# EAGLE design numpad_v1a (EAGLE 9.2.1)

## Sheet 1 of 2: Key Matrix
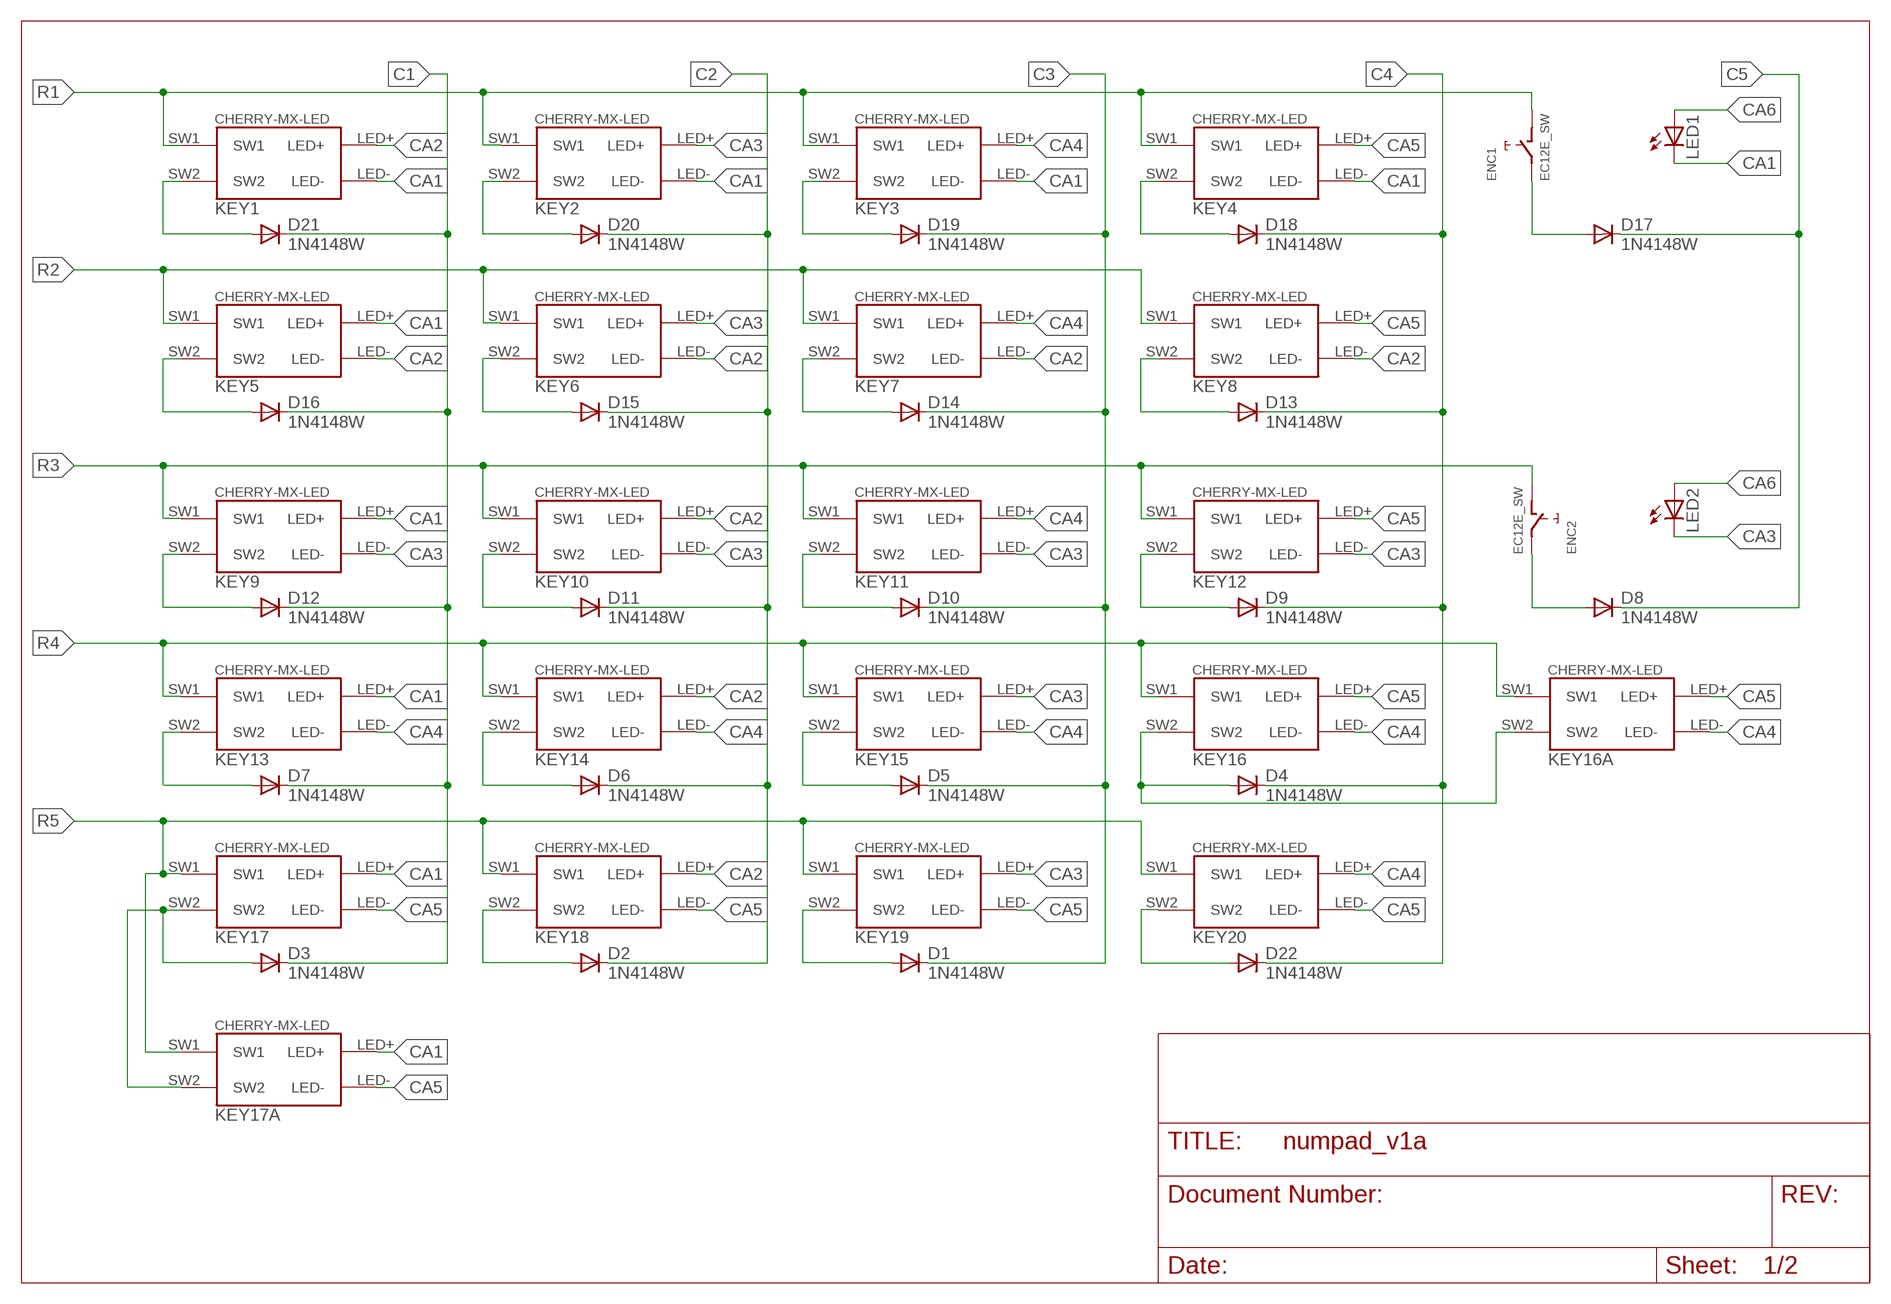
[diagram p0: schematic, sheet 1]

### Parts
D1  1N4148W  DIODE-SOD123  [SOD123]
D2  1N4148W  DIODE-SOD123  [SOD123]
D3  1N4148W  DIODE-SOD123  [SOD123]
D4  1N4148W  DIODE-SOD123  [SOD123]
D5  1N4148W  DIODE-SOD123  [SOD123]
D6  1N4148W  DIODE-SOD123  [SOD123]
D7  1N4148W  DIODE-SOD123  [SOD123]
D8  1N4148W  DIODE-SOD123  [SOD123]
D9  1N4148W  DIODE-SOD123  [SOD123]
D10  1N4148W  DIODE-SOD123  [SOD123]
D11  1N4148W  DIODE-SOD123  [SOD123]
D12  1N4148W  DIODE-SOD123  [SOD123]
D13  1N4148W  DIODE-SOD123  [SOD123]
D14  1N4148W  DIODE-SOD123  [SOD123]
D15  1N4148W  DIODE-SOD123  [SOD123]
D16  1N4148W  DIODE-SOD123  [SOD123]
D17  1N4148W  DIODE-SOD123  [SOD123]
D18  1N4148W  DIODE-SOD123  [SOD123]
D19  1N4148W  DIODE-SOD123  [SOD123]
D20  1N4148W  DIODE-SOD123  [SOD123]
D21  1N4148W  DIODE-SOD123  [SOD123]
D22  1N4148W  DIODE-SOD123  [SOD123]
ENC1  EC12E_SW  [ALPS_EC12E_SW]
ENC2  EC12E_SW  [ALPS_EC12E_SW]
KEY1  CHERRY-MX-LED  [CHERRY-MX-LED]
KEY2  CHERRY-MX-LED  [CHERRY-MX-LED]
KEY3  CHERRY-MX-LED  [CHERRY-MX-LED]
KEY4  CHERRY-MX-LED  [CHERRY-MX-LED]
KEY5  CHERRY-MX-LED  [CHERRY-MX-LED]
KEY6  CHERRY-MX-LED  [CHERRY-MX-LED]
KEY7  CHERRY-MX-LED  [CHERRY-MX-LED]
KEY8  CHERRY-MX-LED  [CHERRY-MX-LED]
KEY9  CHERRY-MX-LED  [CHERRY-MX-LED]
KEY10  CHERRY-MX-LED  [CHERRY-MX-LED]
KEY11  CHERRY-MX-LED  [CHERRY-MX-LED]
KEY12  CHERRY-MX-LED  [CHERRY-MX-LED]
KEY13  CHERRY-MX-LED  [CHERRY-MX-LED]
KEY14  CHERRY-MX-LED  [CHERRY-MX-LED]
KEY15  CHERRY-MX-LED  [CHERRY-MX-LED]
KEY16  CHERRY-MX-LED_NOHOLES  [CHERRY-MX-LED_NOHOLES]
KEY16A  CHERRY-MX-LED  [CHERRY-MX-LED]
KEY17  CHERRY-MX-LED  [CHERRY-MX-LED]
KEY17A  CHERRY-MX-LED_NOHOLES  [CHERRY-MX-LED_NOHOLES]
KEY18  CHERRY-MX-LED  [CHERRY-MX-LED]
KEY19  CHERRY-MX-LED  [CHERRY-MX-LED]
KEY20  CHERRY-MX-LED  [CHERRY-MX-LED]
LED1  LED3MM  [LED3MM]
LED2  LED3MM  [LED3MM]

### Nets
C1: D3.C D7.C D12.C D16.C D21.C ; also sheet 2
C2: D2.C D6.C D11.C D15.C D20.C ; also sheet 2
C3: D1.C D5.C D10.C D14.C D19.C ; also sheet 2
C4: D4.C D9.C D13.C D18.C D22.C ; also sheet 2
C5: D8.C D17.C ; also sheet 2
CA1: KEY1.LED- KEY2.LED- KEY3.LED- KEY4.LED- KEY5.LED+ KEY9.LED+ KEY13.LED+ KEY17.LED+ KEY17A.LED+ LED1.K(C) ; also sheet 2
CA2: KEY1.LED+ KEY5.LED- KEY6.LED- KEY7.LED- KEY8.LED- KEY10.LED+ KEY14.LED+ KEY18.LED+ ; also sheet 2
CA3: KEY2.LED+ KEY6.LED+ KEY9.LED- KEY10.LED- KEY11.LED- KEY12.LED- KEY15.LED+ KEY19.LED+ LED2.K(C) ; also sheet 2
CA4: KEY3.LED+ KEY7.LED+ KEY11.LED+ KEY13.LED- KEY14.LED- KEY15.LED- KEY16.LED- KEY16A.LED- KEY20.LED+ ; also sheet 2
CA5: KEY4.LED+ KEY8.LED+ KEY12.LED+ KEY16.LED+ KEY16A.LED+ KEY17.LED- KEY17A.LED- KEY18.LED- KEY19.LED- KEY20.LED- ; also sheet 2
CA6: LED1.A LED2.A ; also sheet 2
N$1: D21.A KEY1.SW2
N$2: D16.A KEY5.SW2
N$3: D12.A KEY9.SW2
N$4: D7.A KEY13.SW2
N$5: D15.A KEY6.SW2
N$6: D20.A KEY2.SW2
N$7: D11.A KEY10.SW2
N$8: D6.A KEY14.SW2
N$9: D5.A KEY15.SW2
N$10: D10.A KEY11.SW2
N$11: D14.A KEY7.SW2
N$12: D19.A KEY3.SW2
N$22: D8.A ENC2.E
N$23: D17.A ENC1.E
N$34: D3.A KEY17.SW2 KEY17A.SW2
N$35: D2.A KEY18.SW2
N$36: D1.A KEY19.SW2
N$39: D4.A KEY16.SW2 KEY16A.SW2
N$40: D9.A KEY12.SW2
N$41: D13.A KEY8.SW2
N$42: D18.A KEY4.SW2
N$43: D22.A KEY20.SW2
R1: ENC1.D KEY1.SW1 KEY2.SW1 KEY3.SW1 KEY4.SW1 ; also sheet 2
R2: KEY5.SW1 KEY6.SW1 KEY7.SW1 KEY8.SW1 ; also sheet 2
R3: ENC2.D KEY9.SW1 KEY10.SW1 KEY11.SW1 KEY12.SW1 ; also sheet 2
R4: KEY13.SW1 KEY14.SW1 KEY15.SW1 KEY16.SW1 KEY16A.SW1 ; also sheet 2
R5: KEY17.SW1 KEY17A.SW1 KEY18.SW1 KEY19.SW1 KEY20.SW1 ; also sheet 2

## Sheet 2 of 2: µC, LEDs, Display, Encoders
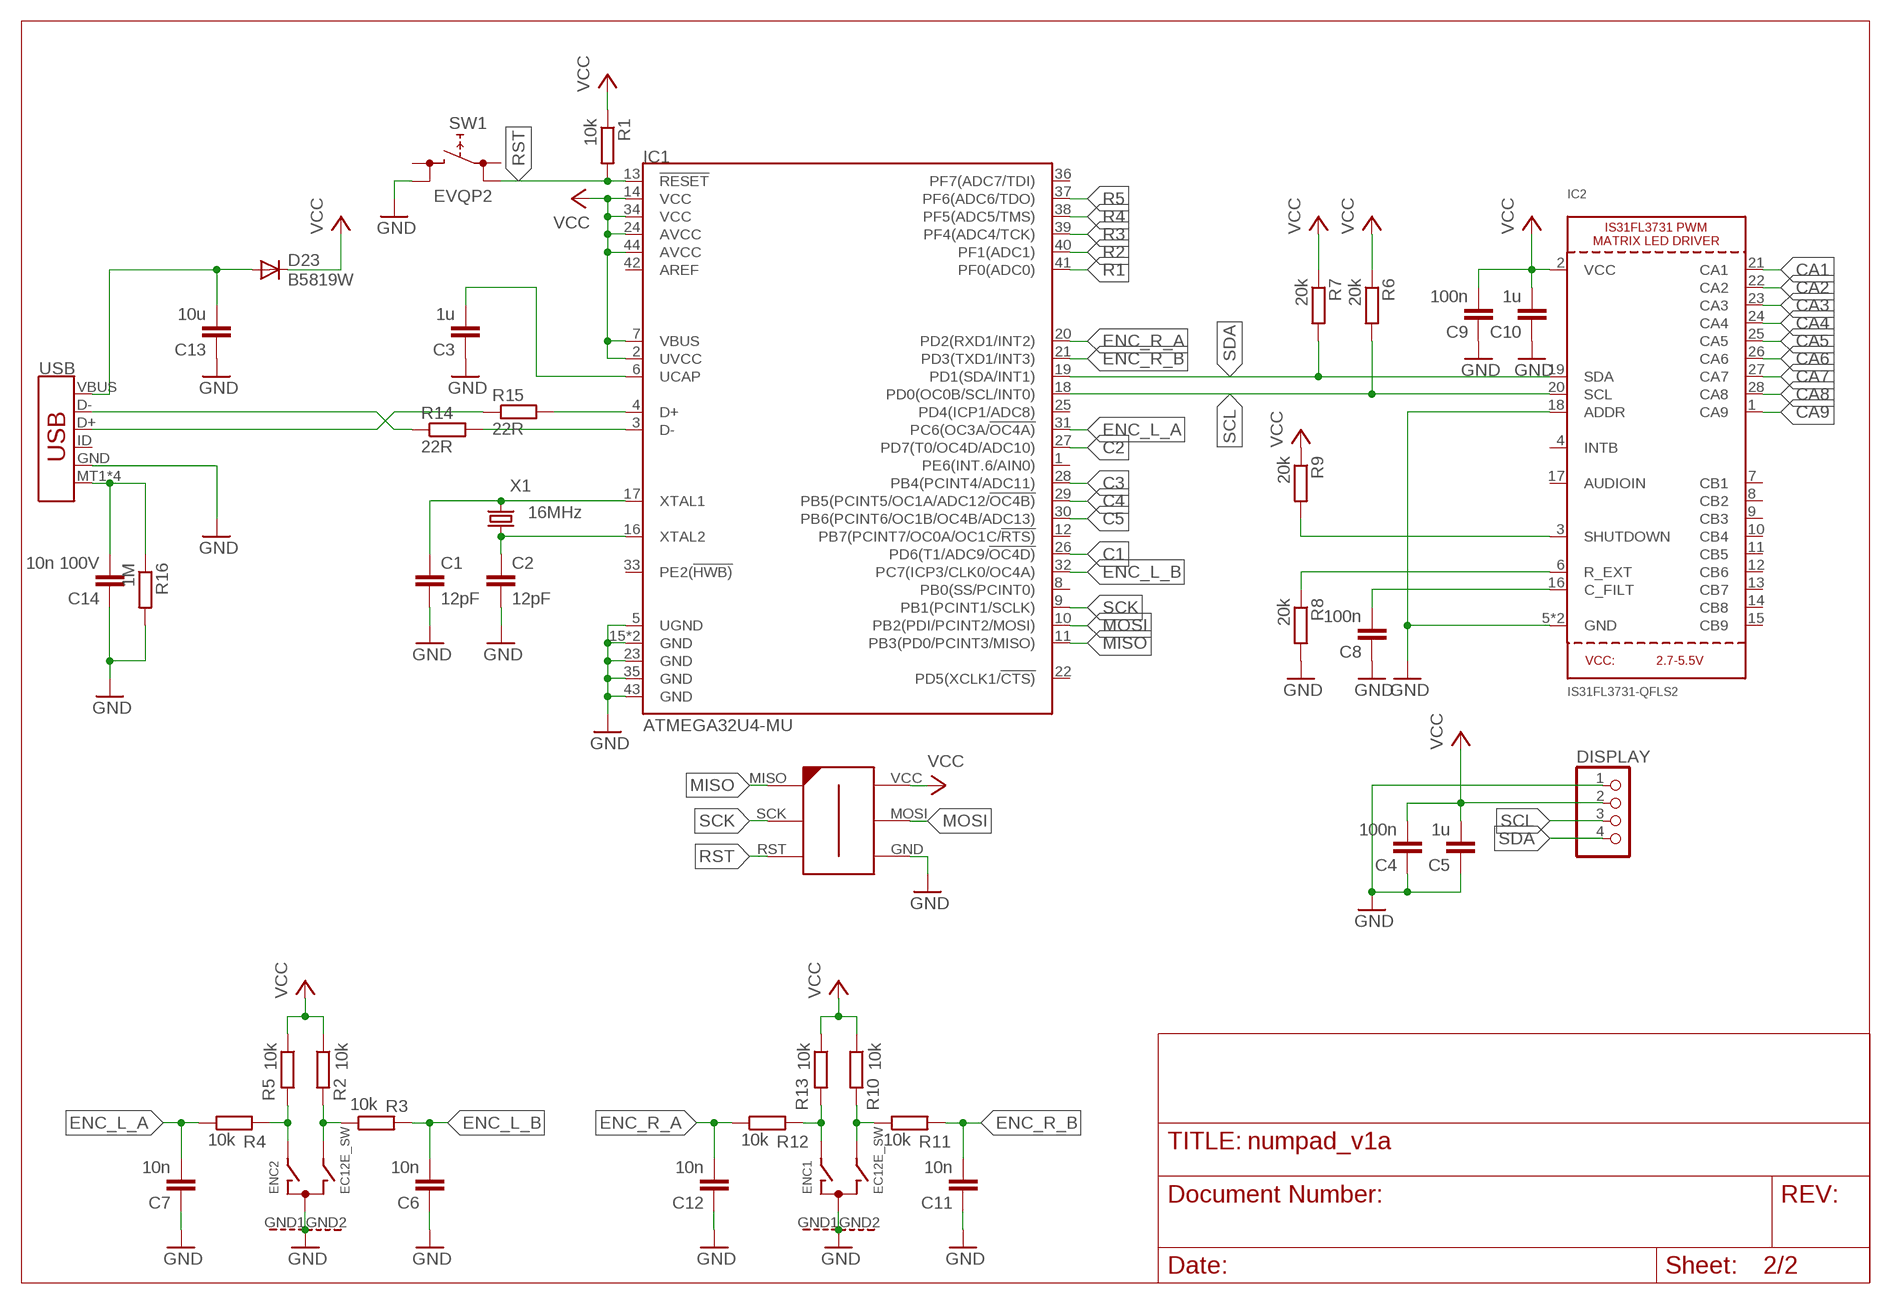
[diagram p1: schematic, sheet 2]

### Parts
C1  12pF  C-EUC0603  [C0603]
C2  12pF  C-EUC0603  [C0603]
C3  1u  C-EUC0603  [C0603]
C4  100n  C-EUC0603  [C0603]
C5  1u  C-EUC0603  [C0603]
C6  10n  C-EUC0603  [C0603]
C7  10n  C-EUC0603  [C0603]
C8  100n  C-EUC0603  [C0603]
C9  100n  C-EUC0603  [C0603]
C10  1u  C-EUC0603  [C0603]
C11  10n  C-EUC0603  [C0603]
C12  10n  C-EUC0603  [C0603]
C13  10u  C-EUC0603  [C0603]
C14  10n 100V  C-EUC0603  [C0603]
D23  B5819W  DIODE-SOD123  [SOD123]
DISPLAY  PINHD-1X4  [1X04]
IC1  ATMEGA32U4-MU  MCU-ATMEGA32U4-MUR(VQFN44)  [QFN44G-0.5-7X7MM]
IC2  IS31FL3731-QFLS2  IS31FL3731QFN  [QFN28_4MM_0.4MM]
ISP  AVR-ISP-6-EDGE  [6PAD_ISP]
R1  10k  R-EU_R0603  [R0603]
R2  10k  R-EU_R0603  [R0603]
R3  10k  R-EU_R0603  [R0603]
R4  10k  R-EU_R0603  [R0603]
R5  10k  R-EU_R0603  [R0603]
R6  20k  R-EU_R0603  [R0603]
R7  20k  R-EU_R0603  [R0603]
R8  20k  R-EU_R0603  [R0603]
R9  20k  R-EU_R0603  [R0603]
R10  10k  R-EU_R0603  [R0603]
R11  10k  R-EU_R0603  [R0603]
R12  10k  R-EU_R0603  [R0603]
R13  10k  R-EU_R0603  [R0603]
R14  22R  R-EU_R0603  [R0603]
R15  22R  R-EU_R0603  [R0603]
R16  1M  R-EU_R0603  [R0603]
SW1  EVQP2  [EVQP2]
USB  USB_MICRO-B_SMT  [USB-MICROB]
X1  16MHz  KX-7  [3.2X2.5_KX-7]

### Nets
C1: IC1.26(PD6(T1/ADC9/!OC4D)) ; also sheet 1
C2: IC1.27(PD7(T0/OC4D/ADC10)) ; also sheet 1
C3: IC1.28(PB4(PCINT4/ADC11)) ; also sheet 1
C4: IC1.29(PB5(PCINT5/OC1A/ADC12/!OC4B)) ; also sheet 1
C5: IC1.30(PB6(PCINT6/OC1B/OC4B/ADC13)) ; also sheet 1
CA1: IC2.21(CA1) ; also sheet 1
CA2: IC2.22(CA2) ; also sheet 1
CA3: IC2.23(CA3) ; also sheet 1
CA4: IC2.24(CA4) ; also sheet 1
CA5: IC2.25(CA5) ; also sheet 1
CA6: IC2.26(CA6) ; also sheet 1
CA7: IC2.27(CA7)
CA8: IC2.28(CA8)
CA9: IC2.1(CA9)
ENC_L_A: C7.2 IC1.31(PC6(OC3A/!OC4A)) R4.1
ENC_L_B: C6.2 IC1.32(PC7(ICP3/CLK0/OC4A)) R3.2
ENC_R_A: C12.2 IC1.20(PD2(RXD1/INT2)) R12.1
ENC_R_B: C11.2 IC1.21(PD3(TXD1/INT3)) R11.2
GND: C1.2 C2.2 C3.1 C4.1 C5.1 C6.1 C7.1 C8.1 C9.1 C10.1 C11.1 C12.1 C13.1 C14.1 DISPLAY.1 ENC1.C ENC1.GND1(G) ENC1.GND2(G) ENC2.C ENC2.GND1(G) ENC2.GND2(G) IC1.5(UGND) IC1.15(GND) IC1.23(GND) IC1.35(GND) IC1.43(GND) IC1.TAB(GND) IC2.5(GND) IC2.18(ADDR) IC2.THERMAL(GND) ISP.GND R8.2 R16.2 SW1.2 USB.GND
MISO: IC1.11(PB3(PD0/PCINT3/MISO)) ISP.MISO
MOSI: IC1.10(PB2(PDI/PCINT2/MOSI)) ISP.MOSI
N$13: IC1.4(D+) R15.2
N$14: IC1.3(D-) R14.2
N$15: R14.1 USB.D-
N$16: R15.1 USB.D+
N$17: C1.1 IC1.17(XTAL1) X1.3
N$18: C13.2 D23.A USB.VBUS
N$19: C2.1 IC1.16(XTAL2) X1.1
N$20: C3.2 IC1.6(UCAP)
N$21: IC2.6(R_EXT) R8.1
N$24: C8.2 IC2.16(C_FILT)
N$25: IC2.3(SHUTDOWN) R9.2
N$26: ENC2.A R4.2 R5.2
N$28: ENC1.A R12.2 R13.2
N$31: ENC2.B R2.2 R3.1
N$33: ENC1.B R10.2 R11.1
N$37: C14.2 R16.1 USB.MT1(SHIELD) USB.MT2(SHIELD) USB.P$1(SHIELD) USB.P$2(SHIELD)
R1: IC1.41(PF0(ADC0)) ; also sheet 1
R2: IC1.40(PF1(ADC1)) ; also sheet 1
R3: IC1.39(PF4(ADC4/TCK)) ; also sheet 1
R4: IC1.38(PF5(ADC5/TMS)) ; also sheet 1
R5: IC1.37(PF6(ADC6/TDO)) ; also sheet 1
RST: IC1.13(!RESET) ISP.RST R1.2 SW1.3
SCK: IC1.9(PB1(PCINT1/SCLK)) ISP.SCK
SCL: DISPLAY.3 IC1.18(PD0(OC0B/SCL/INT0)) IC2.20(SCL) R6.2
SDA: DISPLAY.4 IC1.19(PD1(SDA/INT1)) IC2.19(SDA) R7.2
VCC: C4.2 C5.2 C9.2 C10.2 D23.C DISPLAY.2 IC1.2(UVCC) IC1.7(VBUS) IC1.14(VCC) IC1.24(AVCC) IC1.34(VCC) IC1.44(AVCC) IC2.2(VCC) ISP.VCC R1.1 R2.1 R5.1 R6.1 R7.1 R9.1 R10.1 R13.1
Unconnected: IC1.1(PE6(INT.6/AIN0)) IC1.8(PB0(SS/PCINT0)) IC1.12(PB7(PCINT7/OC0A/OC1C/!RTS)) IC1.22(PD5(XCLK1/!CTS)) IC1.25(PD4(ICP1/ADC8)) IC1.33(PE2(!HWB)) IC1.36(PF7(ADC7/TDI)) IC1.42(AREF) IC2.4(INTB) IC2.7(CB1) IC2.8(CB2) IC2.9(CB3) IC2.10(CB4) IC2.11(CB5) IC2.12(CB6) IC2.13(CB7) IC2.14(CB8) IC2.15(CB9) IC2.17(AUDIOIN) SW1.1 SW1.4 USB.ID

## Library data of the parts
C1 C2 = rcl:C-EU: CAPACITOR, European symbol; LCSC: C38523; SPICEPREFIX: C
C3 C5 C10 = rcl:C-EU: CAPACITOR, European symbol; LCSC: C15849; SPICEPREFIX: C
C4 C8 C9 = rcl:C-EU: CAPACITOR, European symbol; LCSC: C14663; SPICEPREFIX: C
C6 C7 C11 C12 = rcl:C-EU: CAPACITOR, European symbol; LCSC: C57112; SPICEPREFIX: C
C13 = rcl:C-EU: CAPACITOR, European symbol; LCSC: C19702; SPICEPREFIX: C
C14 = rcl:C-EU: CAPACITOR, European symbol; LCSC: C84709; SPICEPREFIX: C
D1-D22 = diode:DIODE-: DIODE; LCSC: C81598
D23 = diode:DIODE-: DIODE; LCSC: C8598
DISPLAY = pinhead:PINHD-1X4: PIN HEADER
ENC1 ENC2 = switch-alps:EC12E_SW: ALPS rotary Encoder EC12E series with switch; MPN: EC12E2424407; OC_FARNELL: 1520813; OC_NEWARK: 74M1068
IC1 = MCU-ATMEGA32U4-MUR_VQFN44_:MCU-ATMEGA32U4-MUR(VQFN44): 310010016; AVAILABILITY: Unavailable; DESCRIPTION: ATmega Series 32 KB Flash 2.5 KB SRAM 16 MHz 8-Bit Microcontroller - MLF/QFN-44; LCSC: C112161; MF: Microchip; MP: ATMEGA32U4-MUR; PACKAGE: VQFN-44 Microchip; PRICE: None
IC2 = microbuilder:IS31FL3731: IS31FL3731 PWM LED Matrix Driver
ISP = avr-7:AVR-ISP-6-EDGE: 6 pin edge connector for ISP with ATMEL MCUs. Developed by Craig Moates (craig at moates dot net). Library by David Blundell (blundar at gmail dot com). Often, even a 6 pin header is really inconvenient for board layout and/or production. This SMD-only header is our de-facto standard for using an edge connector for programming with the help of a 6pin/10pin to edge card adapter.
KEY1-KEY16 KEY16A KEY17 KEY17A KEY18-KEY20 = cherrymx:CHERRY-MX-LED: Cherry MX series keyswitch with LED
LED1 LED2 = led:LED: LED OSRAM: - CHIPLED LG R971, LG N971, LY N971, LG Q971, LY Q971, LO R971, LY R971 LH N974, LH R974 LS Q976, LO Q976, LY Q976 LO Q996 - Hyper CHIPLED LW Q18S LB Q993, LB Q99A, LB R99A - SideLED LS A670, LO A670, LY A670, LG A670, LP A670 LB A673, LV A673, LT A673, LW A673 LH A674 LY A675 LS A676, LA A676, LO A676, LY A676, LW A676 LS A679, LY A679, LG A679 - Hyper Micro SIDELED® LS Y876, LA Y876, LO Y876, LY Y876 LT Y87S - SmartLED LW L88C, LW L88S LB L89C, LB L89S, LG L890 LS L89K, LO L89K, LY L89K LS L896, LA L896, LO L896, LY L896 - TOPLED LS T670, LO T670, LY T670, LG T670, LP T670 LSG T670, LSP T670, LSY T670, LOP T670, LYG T670 LG T671, LOG T671, LSG T671 LB T673, LV T673, LT T673, LW T673 LH T674 LS T676, LA T676, LO T676, LY T676, LB T676, LH T676, LSB T676, LW T676 LB T67C, LV T67C, LT T67C, LS T67K, LO T67K, LY T67K, LW E67C LS E67B, LA E67B, LO E67B, LY E67B, LB E67C, LV E67C, LT E67C LW T67C LS T679, LY T679, LG T679 LS T770, LO T770, LY T770, LG T770, LP T770 LB T773, LV T773, LT T773, LW T773 LH T774 LS E675, LA E675, LY E675, LS T675 LS T776, LA T776, LO T776, LY T776, LB T776 LHGB T686 LT T68C, LB T68C - Hyper Mini TOPLED® LB M676 - Mini TOPLED Santana® LG M470 LS M47K, LO M47K, LY M47K Source: http://www.osram.convergy.de LUXEON: - LUMILED® LXK2-PW12-R00, LXK2-PW12-S00, LXK2-PW14-U00, LXK2-PW14-V00 LXK2-PM12-R00, LXK2-PM12-S00, LXK2-PM14-U00 LXK2-PE12-Q00, LXK2-PE12-R00, LXK2-PE12-S00, LXK2-PE14-T00, LXK2-PE14-U00 LXK2-PB12-K00, LXK2-PB12-L00, LXK2-PB12-M00, LXK2-PB14-N00, LXK2-PB14-P00, LXK2-PB14-Q00 LXK2-PR12-L00, LXK2-PR12-M00, LXK2-PR14-Q00, LXK2-PR14-R00 LXK2-PD12-Q00, LXK2-PD12-R00, LXK2-PD12-S00 LXK2-PH12-R00, LXK2-PH12-S00 LXK2-PL12-P00, LXK2-PL12-Q00, LXK2-PL12-R00 Source: www.luxeon.com KINGBRIGHT: KA-3528ASYC Source: www.kingbright.com
R1-R5 R10-R13 = rcl:R-EU_: RESISTOR, European symbol; LCSC: C25804; SPICEPREFIX: R
R6-R9 = rcl:R-EU_: RESISTOR, European symbol; LCSC: C4184; SPICEPREFIX: R
R14 R15 = rcl:R-EU_: RESISTOR, European symbol; LCSC: C23345; SPICEPREFIX: R
R16 = rcl:R-EU_: RESISTOR, European symbol; LCSC: C22935; SPICEPREFIX: R
SW1 = switch:EVQP2; FARNELL: 2079559; MBM: 1; PREIS: 0,738
USB = SparkFun-Connectors:USB_MICRO-B: USB Type Micro-B Connector Male/female and PTH/SMT variants SparkFun Products: SparkFun microB USB Breakout <https://www.sparkfun.com/products/12035> SparkFun USB microB Plug Breakout <https://www.sparkfun.com/products/10031> SparkFun ESP8266 Thing <https://www.sparkfun.com/products/13231>; DIGIKEY: 609-4052-1-ND; MBM: 1; PREIS: 0.7; PROD_ID: CONN-09505; SF_ID: PRT-08533
X1 = crystal-geyer_V1_0:KX: Quartz Crystals (MHz) SMD: KX - Serie Model Size l/w/h [mm] Frequency Range Frequency Stability Temp. Range [°C] Load Capacitance AECQ 200 availabel Datasheet KX-4 KX-5 KX-6 KX-7 KX-9A KX-9B KX-12A KX-12B KX-13 KX-20 KX-K KX-KS 1.6/1.2/0.3 2.0/1.6/0.45 2.5/2.0/0.55 3.2/2.5/0.8 5.0/3.2/1.0 5.0/3.2/1.1 6.0/3.5/1.1 6.0/3.5/1.0 7.0/5.0 /1.3 11.6/5.5/1.6 12.3/4.5/4.2 12.3/4.5/3.2 24.0 ~ 80.0 MHz 16.0 ~ 80.0 MHz 12.0 ~ 80.0 MHz 8.0 ~ 60.0 MHz 7,68 ~ 300,0 MHz 8,0 ~ 50,0 MHz 8,0 ~ 150,0 MHz 8,0 ~ 50,0 MHz 6,0 ~ 160,0 MHz 3,579 ~ 25,0 MHz 3,579 ~ 70,0 MHz 3,579 ~ 70,0 MHz ±10 … ±50ppm ±10 … ±50ppm ±10 … ±50ppm ±10 … ±50ppm ±10 … ±50ppm ±10 … ±50ppm ±10 … ±50ppm ±10 … ±50ppm ±10 … ±50ppm ±50ppm ±10 … ±50ppm ±10 … ±50ppm (*) -40°C …+85°C (*) -40°C …+125°C (*) -40°C …+125°C (*) -40°C …+125°C (*) -40°C …+105°C (*) -40°C …+105°C (*) -40°C …+125°C (*) -40°C …+105°C (*) -40°C …+105°C (*) -40°C …+105°C (*) -40°C …+85°C (*) -40°C …+85°C 8, 8…16 8, 8…16 10, 8…16 12, 7…20 16, 10…20 16, 10…20 16, 10…20 16, 12…20 16, 12…20 16, 12…20 16, 12…30 16, 12…30 - yes yes yes - - - - - - - - KX-4.pdf <http://www.geyer-electronic.de/uploads/tx_userartikelfrequenz/GEYER-KX-4.pdf> KX-5.pdf <http://www.geyer-electronic.de/uploads/tx_userartikelfrequenz/GEYER-KX-5.pdf> KX-6.pdf <http://www.geyer-electronic.de/uploads/tx_userartikelfrequenz/GEYER-KX-6.pdf> KX-7.pdf <http://www.geyer-electronic.de/uploads/tx_userartikelfrequenz/GEYER-KX-7.pdf> KX-9A.pdf <http://www.geyer-electronic.de/uploads/tx_userartikelfrequenz/GEYER-KX-9A.pdf> KX-9B.pdf <http://www.geyer-electronic.de/uploads/tx_userartikelfrequenz/GEYER-KX-9B.pdf> KX-12A.pdf <http://www.geyer-electronic.de/uploads/tx_userartikelfrequenz/GEYER-KX-12A.pdf> KX-12B.pdf <http://www.geyer-electronic.de/uploads/tx_userartikelfrequenz/GEYER-KX-12B.pdf> KX-13.pdf <http://www.geyer-electronic.de/uploads/tx_userartikelfrequenz/GEYER-KX-13.pdf> KX-20.pdf <http://www.geyer-electronic.de/uploads/tx_userartikelfrequenz/GEYER-KX-20.pdf> KX-K.pdf <http://www.geyer-electronic.de/uploads/tx_userartikelfrequenz/GEYER-KX-K.pdf> KX-KS.pdf <http://www.geyer-electronic.de/uploads/tx_userartikelfrequenz/GEYER-KX-KS.pdf> <http://www.geyer-electronic.de/fileadmin/template/img/logo-geyer-electronic.png> Details see: http://www.geyer-electronic.de/Frequenz-Produkte.9.0.html Created 2016-06-07, Hans Locher 2016 (C) Geyer Quartz Technology KX4,KX5,KX6,KX7,KX9A,KX9B,KX12A,KX12B,KX13,KX20,KXK,KXKS;1612;2016;2520;3225;5032;6035;7050;11655;12345;1,6x1,2;2,0x1,6;2,5x2,0;3,2x2,5;5,0x3,2;6,0x3,5;7,0x5,0;11,6x5,5;12,3x4,5;12,3x4,5;1.6x1.2;2.0x1.6;2.5x2.0;3.2x2.5;5.0x3.2;6.0x3.5;7.0x5.0;11.6x5.5;12.3x4.5;12.3x4.5;; LCSC: C13738

## Board
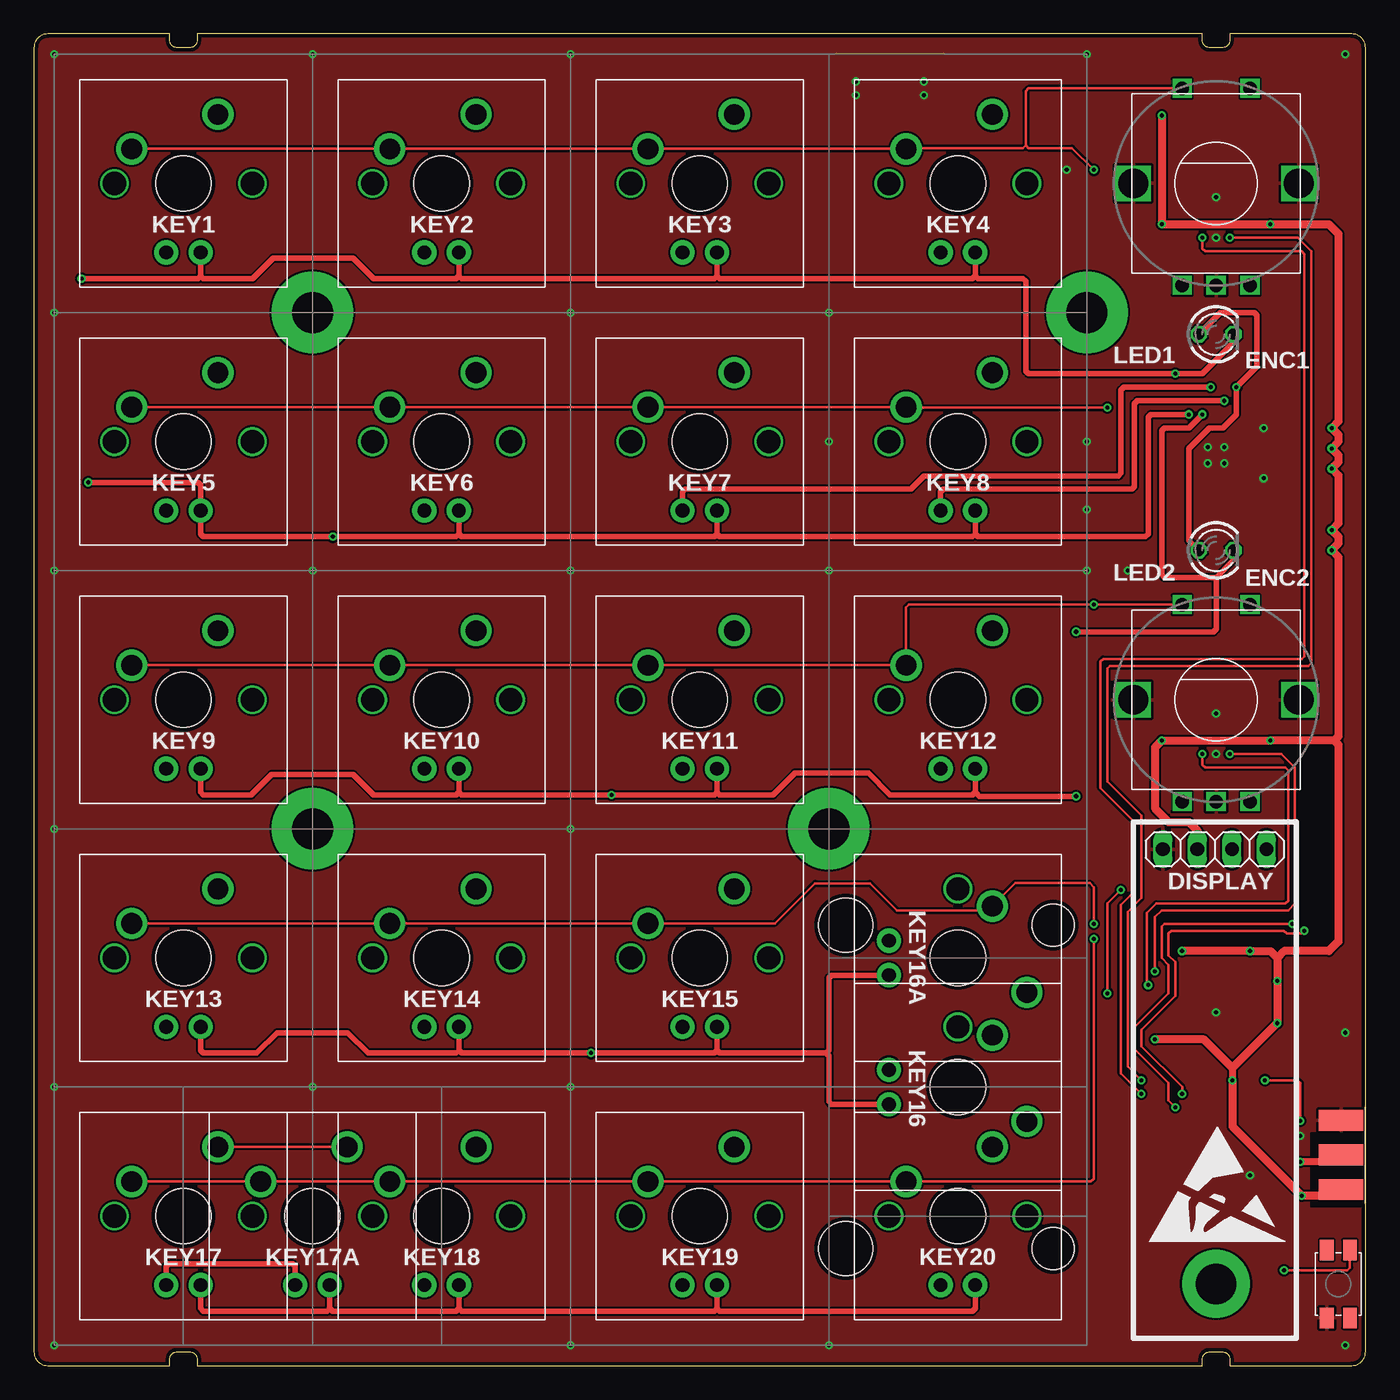
[diagram p2: board, top side]
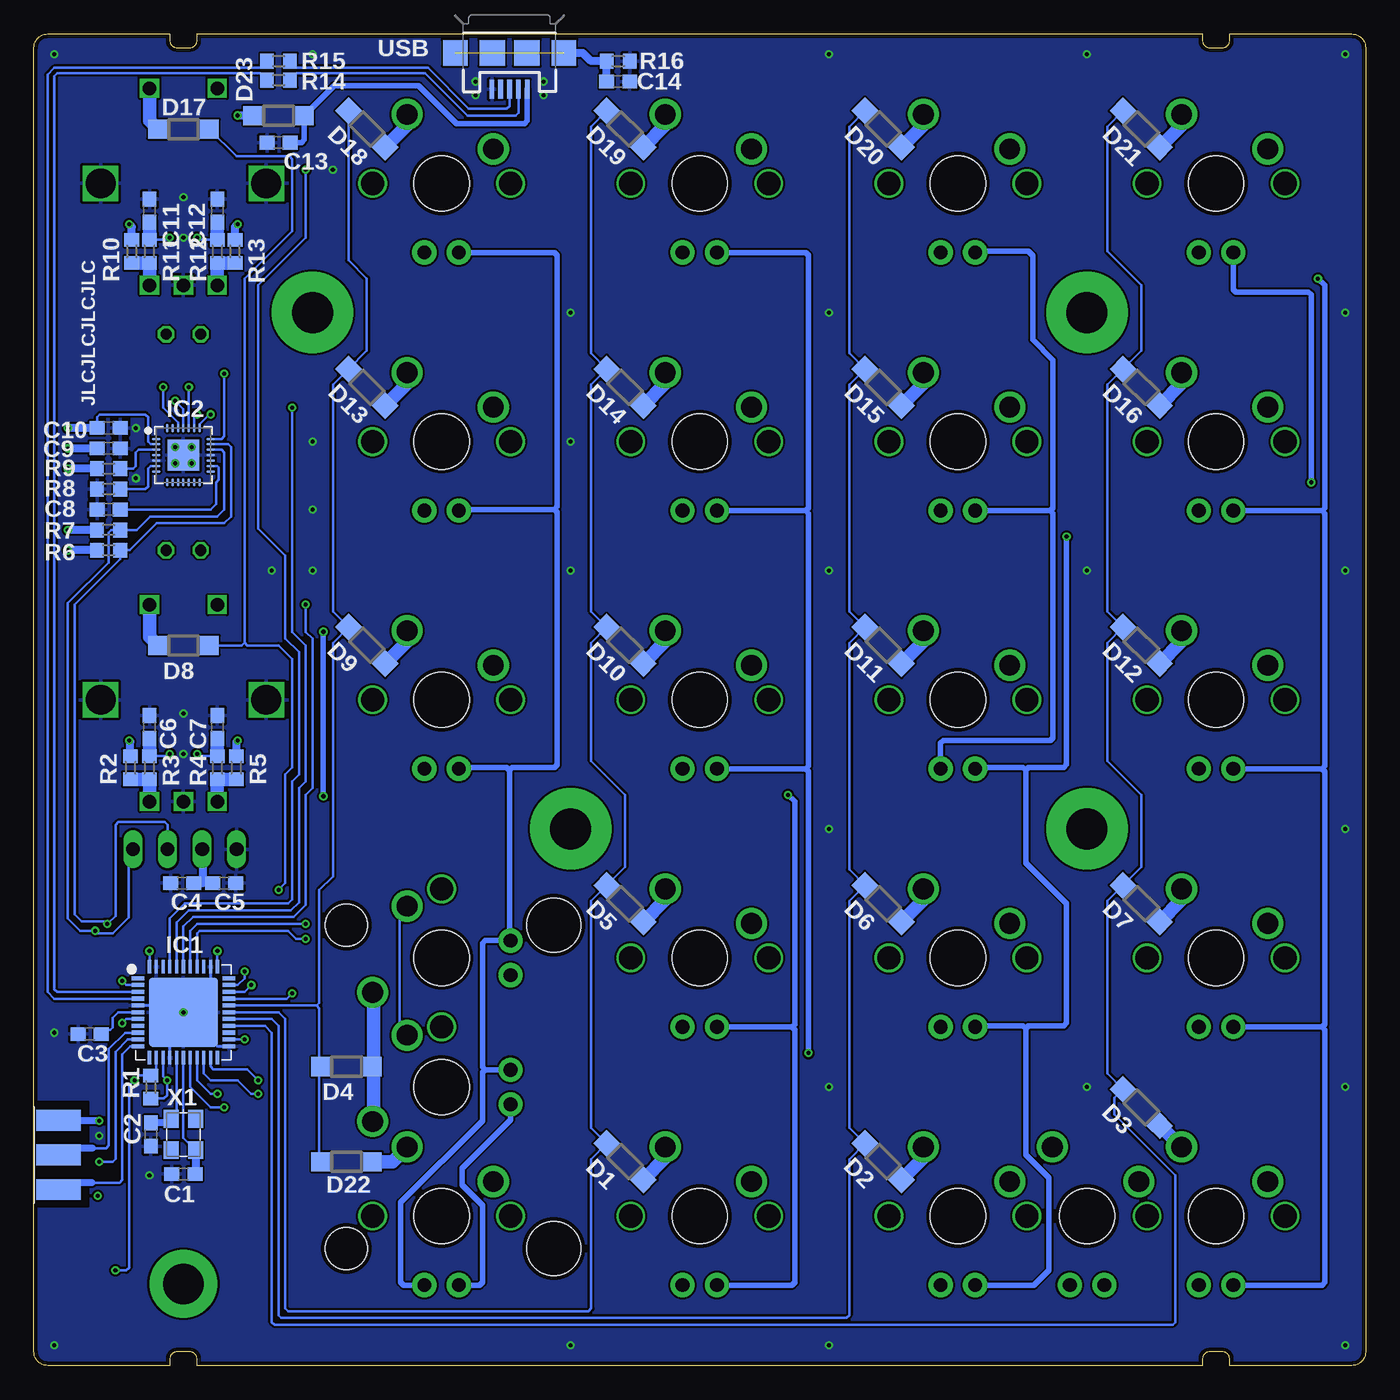
[diagram p3: board, bottom side, seen from below]

Size 98 x 98 mm. Coordinates in mm from the lower left corner, seen from the top.
Outline: 97,98 88,98 88,97.5 arc-90 87.5,97 86.5,97 arc-90 86,97.5 86,98 12,98 12,97.5 arc-90 11.5,97 10.5,97 arc-90 10,97.5 10,98 1,98 arc90 0,97 0,1 arc90 1,0 10,0 10,0.5 arc-90 10.5,1 11.5,1 arc-90 12,0.5 12,0 86,0 86,0.5 arc-90 86.5,1 87.5,1 arc-90 88,0.5 88,0 97,0 arc90 98,1 98,97 arc90 97,98
Copper layers (1*16): Top 0.035mm / dielectric 1.5mm / Bottom 0.035mm
Design rules "PCB-POOL Standard *": minimum track width 0.15mm, minimum drill 0.3mm, track to track 0.15mm, track to pad 0.15mm, pad to pad 0.15mm, via to via 0.15mm, smd to smd 0.15mm, copper to edge 0.3mm, drill to drill 0.2mm, minimum pad ring 0.2mm, minimum via ring 0.15mm, stop-mask expansion 0.075mm, vias tented up to drill 0.3mm, thermal gap 0.2mm
Holes 3.1 mm at 75,32.4 75,8.6
Holes 4 mm at 59.75,8.6 59.75,32.4
tRestrict: 3 lines
bRestrict: 3 lines

### Footprints (pad centres in the part's own frame; a part is rotated, then mirrored left to right if it is on the bottom)
C0603 = smd 1.1 x 1: 1 -0.85,0; 2 0.85,0
SOD123 = smd 1.4 x 1.4: A 1.9,0; C -1.9,0
1X04 = drill 1.016 long: 1 -3.81,0; 2 -1.27,0; 3 1.27,0; 4 3.81,0
ALPS_EC12E_SW = drill 1 square: A -2.5,-7.5; B 2.5,-7.5; C 0,-7.5; D -2.5,7; E 2.5,7 | drill 2.2 square: GND1 -6.1,0; GND2 6.1,0
QFN44G-0.5-7X7MM = smd 1 x 0.3: 1 -3.35,2.5; 2 -3.35,2; 3 -3.35,1.5; 4 -3.35,1; 5 -3.35,0.5; 6 -3.35,0; 7 -3.35,-0.5; 8 -3.35,-1; 9 -3.35,-1.5; 10 -3.35,-2; 11 -3.35,-2.5; 23 3.35,-2.5; 24 3.35,-2; 25 3.35,-1.5; 26 3.35,-1; 27 3.35,-0.5; 28 3.35,0; 29 3.35,0.5; 30 3.35,1; 31 3.35,1.5; 32 3.35,2; 33 3.35,2.5 | smd 0.3 x 1: 12 -2.5,-3.35; 13 -2,-3.35; 14 -1.5,-3.35; 15 -1,-3.35; 16 -0.5,-3.35; 17 0,-3.35; 18 0.5,-3.35; 19 1,-3.35; 20 1.5,-3.35; 21 2,-3.35; 22 2.5,-3.35; 34 2.5,3.35; 35 2,3.35; 36 1.5,3.35; 37 1,3.35; 38 0.5,3.35; 39 0,3.35; 40 -0.5,3.35; 41 -1,3.35; 42 -1.5,3.35; 43 -2,3.35; 44 -2.5,3.35 | smd 5.08 x 5.08: TAB 0,0
QFN28_4MM_0.4MM = smd 0.6 x 0.18: 1 -2,1.2; 2 -2,0.8; 3 -2,0.4; 4 -2,0; 5 -2,-0.4; 6 -2,-0.8; 7 -2,-1.2; 15 2,-1.2; 16 2,-0.8; 17 2,-0.4; 18 2,0; 19 2,0.4; 20 2,0.8; 21 2,1.2 | smd 0.18 x 0.6: 8 -1.2,-2; 9 -0.8,-2; 10 -0.4,-2; 11 0,-2; 12 0.4,-2; 13 0.8,-2; 14 1.2,-2; 22 1.2,2; 23 0.8,2; 24 0.4,2; 25 0,2; 26 -0.4,2; 27 -0.8,2; 28 -1.2,2 | smd 2.3 x 2.3: THERMAL 0,0
6PAD_ISP = smd 1.524 x 3.302 bottom: GND 2.54,0; MOSI 0,0; VCC -2.54,0 | smd 1.524 x 3.302: MISO -2.54,0; RST 2.54,0; SCK 0,0
CHERRY-MX-LED = drill 1.016 pad 1.778: LED+ -1.27,-5.08; LED- 1.27,-5.08 | drill 1.714 pad 1.93: P$3 -5.08,0; P$4 5.08,0 | drill 1.524 pad 2.286: SW1 -3.81,2.54; SW2 2.54,5.08 | hole 4.064: 0,0
CHERRY-MX-LED_NOHOLES = drill 1.016 pad 1.778: LED+ -1.27,-5.08; LED- 1.27,-5.08 | drill 1.524 pad 2.286: SW1 -3.81,2.54; SW2 2.54,5.08 | hole 4.064: 0,0
LED3MM = drill 0.813 octagon: A -1.27,0; K 1.27,0
R0603 = smd 1 x 1.1: 1 -0.85,0; 2 0.85,0
EVQP2 = smd 1.5 x 1: 1 -2.5,-0.85; 2 -2.5,0.85; 3 2.5,-0.85; 4 2.5,0.85
USB-MICROB = smd 1.4 x 0.35: D+ -2.65,0; D- -2.65,-0.65; GND -2.65,1.3; ID -2.65,0.65; VBUS -2.65,-1.3 | smd 1.9 x 1.8: MT1 0,-4; MT2 0,4 | smd 1.9 x 1.9: P$1 0,-1.27; P$2 0,1.27
3.2X2.5_KX-7 = smd 1.3 x 1.1: 1 -1.15,-0.9; 2 1.15,-0.9; 3 1.15,0.9; 4 -1.15,0.9

### Placement (x,y rotation side)
C1  87,14.1 180 bottom
C2  89.4,17 270 bottom
C3  93.9,24.4 0 bottom
C4  87.1,35.5 0 bottom
C5  84,35.5 180 bottom
C6  89.5,47 270 bottom
C7  84.5,47 270 bottom
C8  92.5,63 0 bottom
C9  92.5,67.5 180 bottom
C10  92.5,69 180 bottom
C11  89.5,85 270 bottom
C12  84.5,85 270 bottom
C13  80,90 0 bottom
C14  55,94.5 180 bottom
D1  54.5,15 315 bottom
D2  35.5,15 315 bottom
D3  16.5,19 315 bottom
D4  75,22 0 bottom
D5  54.5,34 315 bottom
D6  35.5,34 315 bottom
D7  16.5,34 315 bottom
D8  87,53 180 bottom
D9  73.5,53 315 bottom
D10  54.5,53 315 bottom
D11  35.5,53 315 bottom
D12  16.5,53 315 bottom
D13  73.5,72 315 bottom
D14  54.5,72 315 bottom
D15  35.5,72 315 bottom
D16  16.5,72 315 bottom
D17  87,91 180 bottom
D18  73.5,91 315 bottom
D19  54.5,91 315 bottom
D20  35.5,91 315 bottom
D21  16.5,91 315 bottom
D22  75,15 0 bottom
D23  80,92 0 bottom
DISPLAY  86.9,38 0 top
ENC1  87,87 0 top
ENC2  87,49 0 top
IC1  87,26 0 bottom
IC2  87,67 0 bottom
ISP  96.2,15.5 90 bottom
KEY1  11,87 0 top
KEY2  30,87 0 top
KEY3  49,87 0 top
KEY4  68,87 0 top
KEY5  11,68 0 top
KEY6  30,68 0 top
KEY7  49,68 0 top
KEY8  68,68 0 top
KEY9  11,49 0 top
KEY10  30,49 0 top
KEY11  49,49 0 top
KEY12  68,49 0 top
KEY13  11,30 0 top
KEY14  30,30 0 top
KEY15  49,30 0 top
KEY16  68,20.5 270 top
KEY16A  68,30 270 top
KEY17  11,11 0 top
KEY17A  20.5,11 0 top
KEY18  30,11 0 top
KEY19  49,11 0 top
KEY20  68,11 0 top
LED1  87,75.9 0 top
LED2  87,60 0 top
R1  89.4,20.5 90 bottom
R2  90.9,44 270 bottom
R3  89.5,44 90 bottom
R4  84.5,44 270 bottom
R5  83.1,44 270 bottom
R6  92.5,60 0 bottom
R7  92.5,61.5 0 bottom
R8  92.5,64.5 180 bottom
R9  92.5,66 0 bottom
R10  90.8,82 270 bottom
R11  89.5,82 90 bottom
R12  84.5,82 270 bottom
R13  83.2,82 270 bottom
R14  80,94.6 180 bottom
R15  80,96 180 bottom
R16  55,96 0 bottom
SW1  96,6 90 top
U$1  [ESD_10.00]  82,9 0 top
USB  63,96.6 90 bottom
X1  87,17 270 bottom

### Tracks (layer width: path | path; a pad name or v marks a point on that pad's centre or on a via)
C1
  Bottom 0.2: D21.C 19,91.19 19,82 16.5,79.5 16.5,74.69 D16.C 19,72.19 19,55.5 D12.C 19,53.19 19,44.5 16.5,42 16.5,36.69 D7.C 19,34.19 19,21.5 D3.C 18.5,19.69 18.5,18.5 14,14 14,3.2 14.2,3 80.3,3 80.5,3.2 80.5,24.5 81,25 IC1.26
C2
  Bottom 0.2: D20.C 38,91.19 38,74.5 D15.C 38,72.19 38,55.5 D11.C 38,53.19 38,36.5 D6.C 38,34.19 38,17.5 D2.C 38,15.19 38,3.7 38.2,3.5 79.8,3.5 80,3.7 80,25 80.5,25.5 IC1.27
C3
  Bottom 0.2: D19.C 57,91.19 57,74.5 D14.C 57,72.19 57,55.5 D10.C 57,53.19 57,44.5 54.5,42 54.5,36.69 D5.C 57,34.19 57,17.5 D1.C 57,15.19 57,4.2 57.2,4 79.3,4 79.5,4.2 79.5,25.5 80,26 IC1.28
C4
  Bottom 0.2: D18.C 74.84,81.34 73.5,80 73.5,74.69 D13.C 76,72.19 76,55.5 D9.C 76,53.19 76,36 77,35 77,26.7 77.2,26.5 | IC1.29 77.2,26.5 | 77.2,26.5 77,26.3 77,22.1 D4.C 77,21.9 77,15.1 D22.C
C5  (via drill 0.3)
  Top 0.2: v80,35 79,34 v79,27.4
  Bottom 0.2: D17.C 83.1,89 79.2,89 79,88.8 79,83.5 82.5,80 82.5,53.2 | 82.5,53.2 82.7,53 D8.C | 82.5,53.2 82.3,53 80,53 79,52 79,44 79.5,43.5 79.5,35.5 v80,35 | v79,27.4 79.4,27 IC1.30
CA1  (via drill 0.3)
  Top 0.2: 31.47,80 31.27,80.2
  Top 0.4: KEY1.LED- 12.27,80.2 | 12.27,80.2 12.47,80 16.1,80 17.6,81.5 23.5,81.5 25,80 31.07,80 31.27,80.2 KEY2.LED- | KEY3.LED- 50.27,80.2 | 50.27,80.2 50.07,80 31.47,80 | v3.5,80 12.07,80 12.27,80.2 | KEY4.LED- 69.27,80.2 | 69.27,80.2 69.07,80 50.47,80 50.27,80.2 | 69.27,80.2 69.47,80 72.8,80 73,79.8 73,73.2 73.2,73 v84,73 86,73 88.27,75.27 LED1.K | KEY17.LED+ 9.73,7.3 9.93,7.5 19.03,7.5 19.23,7.3 KEY17A.LED+
  Bottom 0.2: 3.2,62.92 3,63.12 | IC2.21 84.2,68.2 84,68.4 v84,73
  Bottom 0.4: KEY13.LED+ 3.2,24.92 | 3.2,24.92 3,25.12 3,43.72 3.2,43.92 | 3.2,43.92 KEY9.LED+ | 3.2,43.92 3,44.12 3,62.72 3.2,62.92 KEY5.LED+ | v3.5,80 3,79.5 3,63.12 | KEY17.LED+ 3.2,5.92 3,6.12 3,24.72 3.2,24.92
CA2  (via drill 0.3)
  Top 0.4: 31.27,61.2 31.07,61 v22,61 12.47,61 12.27,61.2 KEY5.LED- 12.27,64.8 12.07,65 v4,65 | 31.27,61.2 KEY6.LED- | KEY7.LED- 50.27,61.2 | 50.27,61.2 50.07,61 31.47,61 31.27,61.2 | KEY8.LED- 69.27,61.2 | 69.27,61.2 69.07,61 50.47,61 50.27,61.2 | 69.27,61.2 69.47,61 81.8,61 82,61.2 82,69.8 82.2,70 v85,70
  Bottom 0.2: IC2.22 85.8,69.3 85.1,70 v85,70
  Bottom 0.4: v22,61 22,44.22 22.2,44.02 24.8,44.02 25,43.82 | KEY1.LED+ 9.73,79.2 9.53,79 4.2,79 4,78.8 v4,65 | KEY10.LED+ 28.63,44.02 25.2,44.02 25,43.82 | KEY18.LED+ 24.4,5.92 23.3,7.02 23.3,13.8 25,15.5 25,24.8 | 25,24.8 24.8,25 22.2,25 22,25.2 22,34 25,37 25,43.82 | 25,24.8 25.2,25 28.65,25 KEY14.LED+
CA3  (via drill 0.3)
  Top 0.4: KEY9.LED- 12.27,42.2 12.47,42 16,42 17.5,43.5 23.5,43.5 25,42 31.07,42 31.27,42.2 | 31.27,42.2 KEY10.LED- | 50.27,42.2 50.07,42 v42.5,42 31.47,42 31.27,42.2 | 50.27,42.2 KEY11.LED- | 50.27,42.2 50.47,42 54.4,42 56,43.6 61.4,43.6 63,42 69.07,42 69.27,42.2 | 69.27,42.2 KEY12.LED- | 69.27,42.2 69.57,41.9 v76.7,41.9 | v76.7,54 86.8,54 87,54.2 87,58 | v86,70 85,69 83.2,69 83,68.8 83,58.2 83.2,58 87,58 | 87,58 88.27,59.27 LED2.K
  Bottom 0.2: 28.65,82 KEY2.LED+ | IC2.23 86.2,69.8 v86,70
  Bottom 0.4: KEY6.LED+ 23.2,62.92 | 23.2,62.92 23,63.12 23,74 24.5,75.5 24.5,81.7 24.8,82 28.65,82 | v42.5,42 42,41.5 42,25.12 42.2,24.92 | KEY10.LED- 31.27,45.8 31.07,46 23.2,46 23,46.2 23,62.72 23.2,62.92 | 42.2,24.92 KEY15.LED+ | KEY19.LED+ 42.2,5.92 42,6.12 42,24.72 42.2,24.92 | v76.7,54 v76.7,41.9
CA4  (via drill 0.3)
  Top 0.2: 31.07,23 31.27,23.2
  Top 0.4: KEY13.LED- 12.27,23.2 12.47,23 16.4,23 17.9,24.5 23.1,24.5 24.6,23 31.07,23 | KEY14.LED- 31.27,23.2 31.47,23 v41,23 50.07,23 50.27,23.2 | KEY15.LED- 50.27,23.2 | 50.27,23.2 50.47,23 58.3,23 | 58.3,23 58.5,22.8 58.5,19.43 58.7,19.23 KEY16.LED- | v86.6,72 80.2,72 80,71.8 80,65.67 79.8,65.47 65.5,65.47 64.53,64.5 47.93,64.5 47.73,64.3 KEY7.LED+ | 58.3,23 58.5,23.2 58.5,28.53 58.7,28.73 KEY16A.LED-
  Bottom 0.2: IC2.24 v86.6,72
  Bottom 0.4: KEY11.LED+ 41.2,43.92 | 41.2,43.92 41,44.12 41,62.72 41.2,62.92 | 41.2,62.92 KEY7.LED+ | 41.2,62.92 41,63.12 41,81.72 41.2,81.92 KEY3.LED+ | 41.2,43.92 41,43.72 v41,23 | KEY20.LED+ 65.2,5.92 65,6.12 65,11.8 66.5,13.3 66.5,14.5 62.92,18.08 KEY16.LED-
CA5  (via drill 0.3)
  Top 0.4: KEY17.LED- 12.27,4.2 12.47,4 21.57,4 21.77,4.2 | 31.27,4.2 31.07,4 21.97,4 21.77,4.2 | 31.27,4.2 KEY18.LED- | 31.27,4.2 31.47,4 50.07,4 50.27,4.2 | 50.27,4.2 KEY19.LED- | 50.27,4.2 50.47,4 69.07,4 69.27,4.2 KEY20.LED- | KEY8.LED+ 66.73,64.3 66.93,64.5 80.8,64.5 81,64.7 81,70.8 81.2,71 v87.6,71 | 21.77,4.2 KEY17A.LED-
  Bottom 0.2: v87.6,71 87,70.4 IC2.25
  Bottom 0.4: KEY4.LED+ 59.7,81.92 59.5,81.72 59.5,63.2 59.7,63 | KEY8.LED+ 66.65,63 59.7,63 | 59.7,63 59.5,62.8 59.5,44.2 59.7,44 62.8,44 63,43.8 | 64.8,21.77 65,21.57 65,18 71,12 71,6.12 70.8,5.92 KEY20.LED- | 64.8,21.77 65,21.97 65,31.07 64.8,31.27 KEY16A.LED+ 63,31.35 63,43.8 | KEY16.LED+ 64.8,21.77 | 63,43.8 63.2,44 66.65,44 KEY12.LED+
CA6  (via drill 0.3)
  Top 0.4: LED1.A 87.33,77.5 89.8,77.5 90,77.3 90,73.5 v88.5,72 88.5,70 87.5,69 86.5,69 85,67.5 85,60.73 LED2.A
  Bottom 0.2: IC2.26 87.4,69.4 88.5,70.5 v88.5,72
ENC_L_A  (via drill 0.3)
  Top 0.2: v82,28 81.9,28 81.9,33.3 82.6,34 92.1,34 92.3,34.2 92.3,43.8 92.1,44 86.2,44 86,44.2 v86,45
  Bottom 0.2: IC1.31 82.5,27.5 v82,28 | v86,45 85.85,44.85 R4.1
  Bottom 1: R4.1 C7.2
ENC_L_B  (via drill 0.3)
  Top 0.2: v82.5,29 82.5,33 83,33.5 92.3,33.5 92.8,34 92.8,44 91.8,45 v88,45
  Bottom 0.2: IC1.32 83,28 82.5,28.5 v82.5,29 | v88,45 88.15,44.85 R3.2
  Bottom 1: R3.2 C6.2
ENC_R_A  (via drill 0.3)
  Top 0.2: v81.5,20 80,21.5 80,33.9 81,34.9 81,40 78.5,42.5 78.5,51.8 78.7,52 93.3,52 93.5,52.2 93.5,81.8 93.3,82 86.2,82 86,82.2 v86,83
  Bottom 0.2: IC1.20 85.5,21.5 85,21 83,21 82,20 v81.5,20 | v86,83 85.85,82.85 R12.1
  Bottom 1: R12.1 C12.2
ENC_R_B  (via drill 0.3)
  Top 0.2: v81.5,21 80.5,22 80.5,33.4 81.5,34.4 81.5,40.5 79,43 79,51.3 79.2,51.5 93.8,51.5 94,51.7 94,82 93,83 v88,83
  Bottom 0.2: IC1.21 85,22 84.8,21.8 82.3,21.8 v81.5,21 | v88,83 88.15,82.85 R11.2
  Bottom 1: R11.2 C11.2
GND  (via drill 0.3)
  Bottom 0.2: IC1.5 87.2,26.5 87,26.3 IC1.TAB | IC1.TAB 88,25 IC1.15 | IC1.35 85,28 IC1.TAB | IC1.23 84.5,23.5 IC1.TAB
  other vias: 87,26 87,86 87,48 89.5,14 87.6,66.4 90.5,69 86.4,66.4 87.6,67.6 86.4,67.6 20.5,58.5 39.5,58.5 20.5,20.5 1.5,1.5 96.5,1.5 58.5,1.5 39.5,1.5 39.5,39.5 39.5,77.5 58.5,58.5 65.5,94.5 60.5,94.5 76,88 80.5,58.5 90.5,65.3 58.5,68 77.5,68 77.5,63 96.5,24.5 93.2,16.9 87,83 87,45 65.5,93.5 60.5,93.5 58.5,77.5 1.5,96.5 20.5,96.5 39.5,96.5 77.5,96.5 96.5,96.5 1.5,77.5 1.5,58.5 1.5,39.5 1.5,20.5 39.5,20.5 77.5,58.5
  pour Top: 97,98 1,98 arc90 0,97 0,1 arc90 1,0 97,0 arc90 98,1 98,97 arc90
  pour Bottom: 97,98 1,98 arc90 0,97 0,1 arc90 1,0 97,0 arc90 98,1 98,97 arc90
MISO
  Bottom 0.2: IC1.11 90.9,23.5 91.5,22.9 91.5,13.66 91.7,13.46 93.74,13.46
  Bottom 0.5: ISP.MISO 95.7,13.46 93.74,13.46
MOSI  (via drill 0.3)
  Top 0.5: ISP.MOSI 95.7,15 v93.2,15
  Bottom 0.2: IC1.10 91.1,24 92,23.1 92,15.2 92.2,15 v93.2,15
N$1
  Bottom 1: KEY1.SW2 13.55,91.26 D21.A
N$2
  Bottom 1: KEY5.SW2 13.54,72.27 D16.A
N$3
  Bottom 1: KEY9.SW2 13.54,53.27 D12.A
N$4
  Bottom 1: KEY13.SW2 13.54,34.27 D7.A
N$5
  Bottom 1: KEY6.SW2 32.54,72.27 D15.A
N$6
  Bottom 1: KEY2.SW2 32.54,91.27 D20.A
N$7
  Bottom 1: KEY10.SW2 32.54,53.27 D11.A
N$8
  Bottom 1: KEY14.SW2 32.54,34.27 D6.A
N$9
  Bottom 1: KEY15.SW2 51.54,34.27 D5.A
N$10
  Bottom 1: KEY11.SW2 51.54,53.27 D10.A
N$11
  Bottom 1: KEY7.SW2 51.54,72.27 D14.A
N$12
  Bottom 1: KEY3.SW2 51.54,91.27 D19.A
N$13
  Bottom 0.2: R15.2 81.35,95.5 96.5,95.5 97,95 97,27.5 96.5,27 IC1.4
N$14
  Bottom 0.2: R14.2 81.35,95.1 96.3,95.1 96.5,94.9 96.5,27.7 96.3,27.5 IC1.3
N$15
  Bottom 0.2: R14.1 78.65,95.1 69.2,95.1 66.1,92 62.55,92 62.35,92.2 USB.D-
N$16
  Bottom 0.2: R15.1 78.65,95.5 69,95.5 66,92.5 63.2,92.5 63,92.7 USB.D+
N$17
  Bottom 0.2: IC1.17 87,16.75 X1.3
  Bottom 0.6: X1.3 86.1,14.15 C1.1
N$18
  Bottom 0.4: C13.2 78.3,90 78.1,90.2 D23.A 75.9,94.2 69.7,94.2 66.9,91.4 61.9,91.4 61.7,91.6 USB.VBUS
N$19
  Bottom 0.2: IC1.16 87.5,18.55 X1.1
  Bottom 0.5: X1.1 88.2,17.85 C2.1
N$20
  Bottom 0.2: IC1.6 91.8,26 92.2,25.6 92.2,24.9 92.4,24.7 92.75,24.7 C3.2
N$21
  Bottom 0.2: IC2.6 89.4,66.2 89.6,66 89.6,64.7 89.8,64.5 R8.1
N$22
  Bottom 1: D8.A 89.5,53.6 ENC2.E
N$23
  Bottom 1: D17.A 89.5,91.6 ENC1.E
N$24
  Bottom 0.2: IC2.16 84.51,66.2 84.4,66.09 84.4,65.2 84.6,65 84.6,63.4 85,63 C8.2
N$25
  Bottom 0.2: IC2.3 90.3,67.4 90.5,67.2 90.5,66.2 90.7,66 R9.2
N$26
  Bottom 1: R5.2 R4.2 ENC2.A
N$27  (via drill 3 pad 6)
  other vias: 20.5,77.5
N$28
  Bottom 1: R13.2 R12.2 ENC1.A
N$29  (via drill 3 pad 6)
  other vias: 77.5,77.5
N$30  (via drill 3 pad 6)
  other vias: 20.5,39.5
N$31
  Bottom 1: R2.2 R3.1 ENC2.B
N$32  (via drill 3 pad 6)
  other vias: 58.5,39.5
N$33
  Bottom 1: R10.2 R11.1 ENC1.B
N$34
  Top 0.2: KEY17A.SW2 KEY17.SW2
  Bottom 1: D3.A 15.12,17.66 KEY17.SW2
N$35
  Bottom 1: KEY18.SW2 32.54,15.27 D2.A
N$36
  Bottom 1: KEY19.SW2 51.54,15.27 D1.A
N$37  (3 unrouted)
  Bottom 0.6: C14.2 R16.1 57,96 57.6,96.6 USB.MT1
N$38  (via drill 3 pad 5)
  other vias: 87,6
N$39
  Bottom 0.6: 73,21.9 D4.A 73,22.1 | KEY16A.SW2 73,27.38
  Bottom 1: 73,27.38 73,22.1 | KEY16.SW2 73,18.04 73,21.9
N$40
  Bottom 1: KEY12.SW2 70.54,53.27 D9.A
N$41
  Bottom 1: KEY8.SW2 70.54,72.27 D13.A
N$42
  Bottom 1: KEY4.SW2 70.54,91.27 D18.A
N$43
  Bottom 1: D22.A 71.62,15 KEY20.SW2
R1  (via drill 0.3)
  Top 0.2: KEY1.SW1 KEY2.SW1 KEY3.SW1 KEY4.SW1 64.19,89.56 64.23,89.6 72.8,89.6 73,89.8 | ENC1.D 73.2,94 73,93.8 73,89.8 | 73,89.8 73.2,89.6 76.4,89.6 v78,88
  Bottom 0.2: v78,88 78,83 81.5,79.5 81.5,61.6 79.5,59.6 79.5,53.5 78.5,52.5 78.5,43.5 79,43 79,34.3 79.3,34 86.9,34 88,32.9 IC1.41
R2  (via drill 0.3)
  Top 0.2: KEY5.SW1 KEY6.SW1 KEY7.SW1 KEY8.SW1 64.23,70.5 v79,70.5
  Bottom 0.2: v79,70.5 79,54 78,53 78,43 78.5,42.5 78.5,34.1 79.1,33.5 86.6,33.5 87.5,32.6 IC1.40
R3  (via drill 0.3)
  Top 0.2: KEY9.SW1 KEY10.SW1 KEY11.SW1 KEY12.SW1 64.19,55.8 64.39,56 v78,56 ENC2.D
  Bottom 0.2: IC1.39 87,32.3 86.3,33 78.9,33 78,33.9 78,42 77.5,42.5 77.5,53.5 78,54 v78,56
R4  (via drill 0.3)
  Top 0.2: KEY13.SW1 KEY14.SW1 KEY15.SW1 54.54,32.54 57.48,35.48 61.52,35.48 63.5,33.5 70.23,33.5 KEY16A.SW1 72.23,35.5 77.7,35.5 78,35.2 v78,32.5
  Bottom 0.2: v78,32.5 86,32.5 86.5,32 IC1.38 | KEY16A.SW1 71.1,33.25 71.1,24.87 KEY16.SW1
R5  (via drill 0.3)
  Top 0.2: v78,31.4 78,13.74 77.8,13.54 KEY20.SW1 KEY19.SW1 KEY18.SW1 KEY17A.SW1 KEY17.SW1
  Bottom 0.2: v78,31.4 78.7,31.4 79.3,32 85.8,32 86,31.8 IC1.37
RST  (via drill 0.3)
  Top 0.2: v90.6,21 93,21 93.2,20.8 v93.2,18 | v92,7 96.65,7 96.85,7.2 SW1.3
  Bottom 0.2: IC1.13 89,21.75 R1.2 90.25,21.35 v90.6,21 91,20.6 91,7.2 91.2,7 v92,7 | 96.16,18 ISP.RST
  Bottom 0.5: v93.2,18 96.16,18
SCK
  Bottom 0.2: IC1.9 91.3,24.5 92.5,23.3 92.5,16.2 92.7,16 93.7,16
  Bottom 0.5: ISP.SCK 95.7,16 93.7,16
SCL  (via drill 0.3)
  Top 0.2: v92.6,32.5 83.2,32.5 83,32.3 83,30 83.5,29.5 83.5,27.4 81,24.9 81,23.3 83.5,20.8 83.5,19.5 v84,19
  Bottom 0.2: v84,19 85,19 86.5,20.5 IC1.18 | IC2.20 83.7,67.8 83.5,67.6 83.5,62.5 84,62 88.95,62 90.95,60 R6.2 91.65,59.35 95,56 95,33.2 94.5,32.7 92.8,32.7 v92.6,32.5 92,33.1 92,39.8 91.8,40 88.37,40 88.17,39.8 DISPLAY.3
SDA  (via drill 0.3)
  Top 0.2: v93.5,32 93.3,31.8 92.2,31.8 92,32 83.7,32 83.5,31.8 83.5,30.2 84,29.7 84,27.2 81.5,24.7 81.5,23.5 84.5,20.5 v84.5,20
  Bottom 0.2: v84.5,20 85,20 86,21 IC1.19 | IC2.19 84.2,67.4 84,67.2 84,63 84.5,62.5 89.45,62.5 90.45,61.5 R7.2 92.3,61.5 92.5,61.3 92.5,59.1 95.5,56.1 95.5,32.9 94.6,32 v93.5,32 93.3,31.8 92.2,31.8 91.01,32.99 91.01,37.7 DISPLAY.4
VCC  (via drill 0.3)
  Top 0.5: ISP.VCC 95.74,12.5 | 88.2,21.9 v88.2,21
  Top 0.6: 95.74,12.5 v93.3,12.5 88.2,17.6 v88.2,21 | v83,92 v83,84 v91,84 95.3,84 96,83.3 96,69.5 v95.5,69 96,68.5 96,68 v95.5,67.5 96,67 96,66.5 v95.5,66 96,65.5 96,62 v95.5,61.5 96,61 96,60.5 v95.5,60 96,59.5 96,46.3 95.7,46 | 95.7,46 v91,46 v83,46 82.5,45.5 82.5,41 83.5,40 85,40 85.63,39.37 DISPLAY.2 | 95.7,46 96,45.7 96,31.2 95.3,30.5 92,30.5 91.5,30 | v84.5,30.5 v89.5,30.5 91,30.5 91.5,30 | 91.5,30 v91.5,28.3 v91.5,25.2 88.2,21.9 86.1,24 v82.5,24
  Bottom 0.2: IC1.2 91.2,28 v91.5,28.3 | IC1.24 v82.5,24 | IC1.7 91.2,25.5 v91.5,25.2 | IC1.14 88.5,21.3 v88.2,21 88.2,19.9 88.45,19.65 R1.1 | IC1.44 v89.5,30.5 | IC2.2 89.4,67.8 89.6,68 89.6,69.8 89.8,70 93.15,70 93.35,69.8 C10.2 | IC1.34 v84.5,30.5
  Bottom 0.6: R2.1 90.9,45.9 v91,46 | R5.1 83.1,45.9 v83,46 | R13.1 83.2,83.8 v83,84 | R10.1 90.8,83.8 v91,84 | D23.C v83,92 | C9.2 v95.5,67.5 | R9.1 v95.5,66 | C10.2 v95.5,69 | R7.1 v95.5,61.5 | R6.1 v95.5,60 | C5.2 85.6,35.5 | 85.6,35.5 C4.2 | DISPLAY.2 85.6,37.97 85.6,35.5

### Text on the board
bPlace: JLCJLCJLCJLC
tStop: NumPad v1 | LCK | / | X | = | X | 7 | 8 | 9 | - | Y | 4 | 5 | 6 | + | 1 | 2 | 3 | ISP | 0 | 00 | , | RST
bStop: C1 | C2 | C3 | C4 | C5 | R1 | R2 | R3 | R4 | R5 | 101119kw